# Altium schematic sheet 12_TO_3V3_VOLTAGE_DIVIDER.SchDoc
size A4
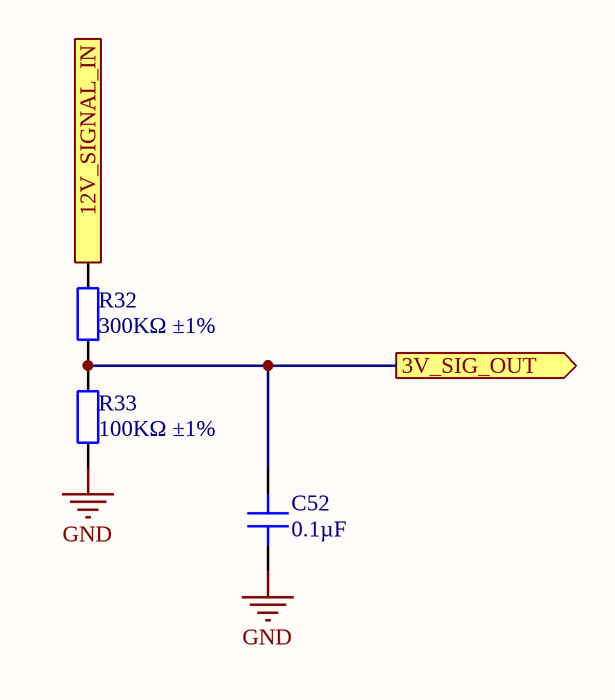
[diagram p0: 12_TO_3V3_VOLTAGE_DIVIDER.SchDoc]

## Parts
C52  0.1µF  [CAP 0402_1005]
R32  300KΩ ±1%  [0402_R]
R33  100KΩ ±1%  [0402_R]

## Ports
3V_SIG_OUT (out), 12V_SIGNAL_IN

## Nets
GND: C52.1 R33.1
3V_SIG_OUT: C52.2 R32.1 R33.2 ; port 3V_SIG_OUT
12V_SIGNAL_IN: R32.2 ; port 12V_SIGNAL_IN

## Library data of the parts
C52 = C0402C104K4RECAUTO: CAP CER 0402 0.1UF 16V X7R 10%; Manufacturer: KEMET; Part Number: C0402C104K4RECAUTO; Value: 0.1µF; Applications: Automotive, ESD Protection; Capacitance: 0.1µF; ComponentLink1Description: Datasheet; ComponentLink1URL: https://api.kemet.com/component-edge/download/datasheet/C0402C104K4RECAUTO.pdf; ComponentLink2Description: DigiKey Link; ComponentLink2URL: http://digikey.com/product-detail/en/kemet/C0402C104K4RECAUTO/399-17167-1-ND/8563708; Device Package: 0402 (1005 Metric); LastUpdated: 2020-09-02 1:02:25 AM; Lifecycle Status: Active; Minimum Order: 1; Mounting Type: Surface Mount, MLCC; Operating Temperature: -55°C ~ 125°C; Package / Case: 0402 (1005 Metric); Packaging: TapeAndReel; PartId: 1731; Part Status: Active; Price: 0.02; Series: ESD SMD Auto X7R; Size / Dimension: 0.039" L x 0.020" W (1.00mm x 0.50mm); Supplier 1: DigiKey; Supplier Part Number 1: 399-17167-1-ND; Temperature Coefficient: X7R; Thickness (Max): 0.022" (0.55mm); Tolerance: ±10%; Voltage - Rated: 16V; Ratings: AEC-Q200
R32 = 0402 300K (3003) 1%: Chip resistor; Manufacturer: Uniroyal Elec; PartNumber: 0402WGF3003TCE; Power: 1/16W; ComponentLink1Description: Supplier link; ComponentLink1URL: http://www.szlcsc.com/product/details_26517.html; Package: 0402; Supplier: LC; SuppliersPartNumber: C25774; Resistance: 300KΩ; Tolerance: 1%
R33 = 0402 100K (1003) 1%: Chip resistor; Manufacturer: Uniroyal Elec; PartNumber: 0402WGF1003TCE; Power: 1/16W; ComponentLink1Description: Supplier link; ComponentLink1URL: http://www.szlcsc.com/product/details_26484.html; Package: 0402; Supplier: LC; SuppliersPartNumber: C25741; Resistance: 100KΩ; Tolerance: 1%